# Altium schematic sheet Sheet1.SchDoc
size A2
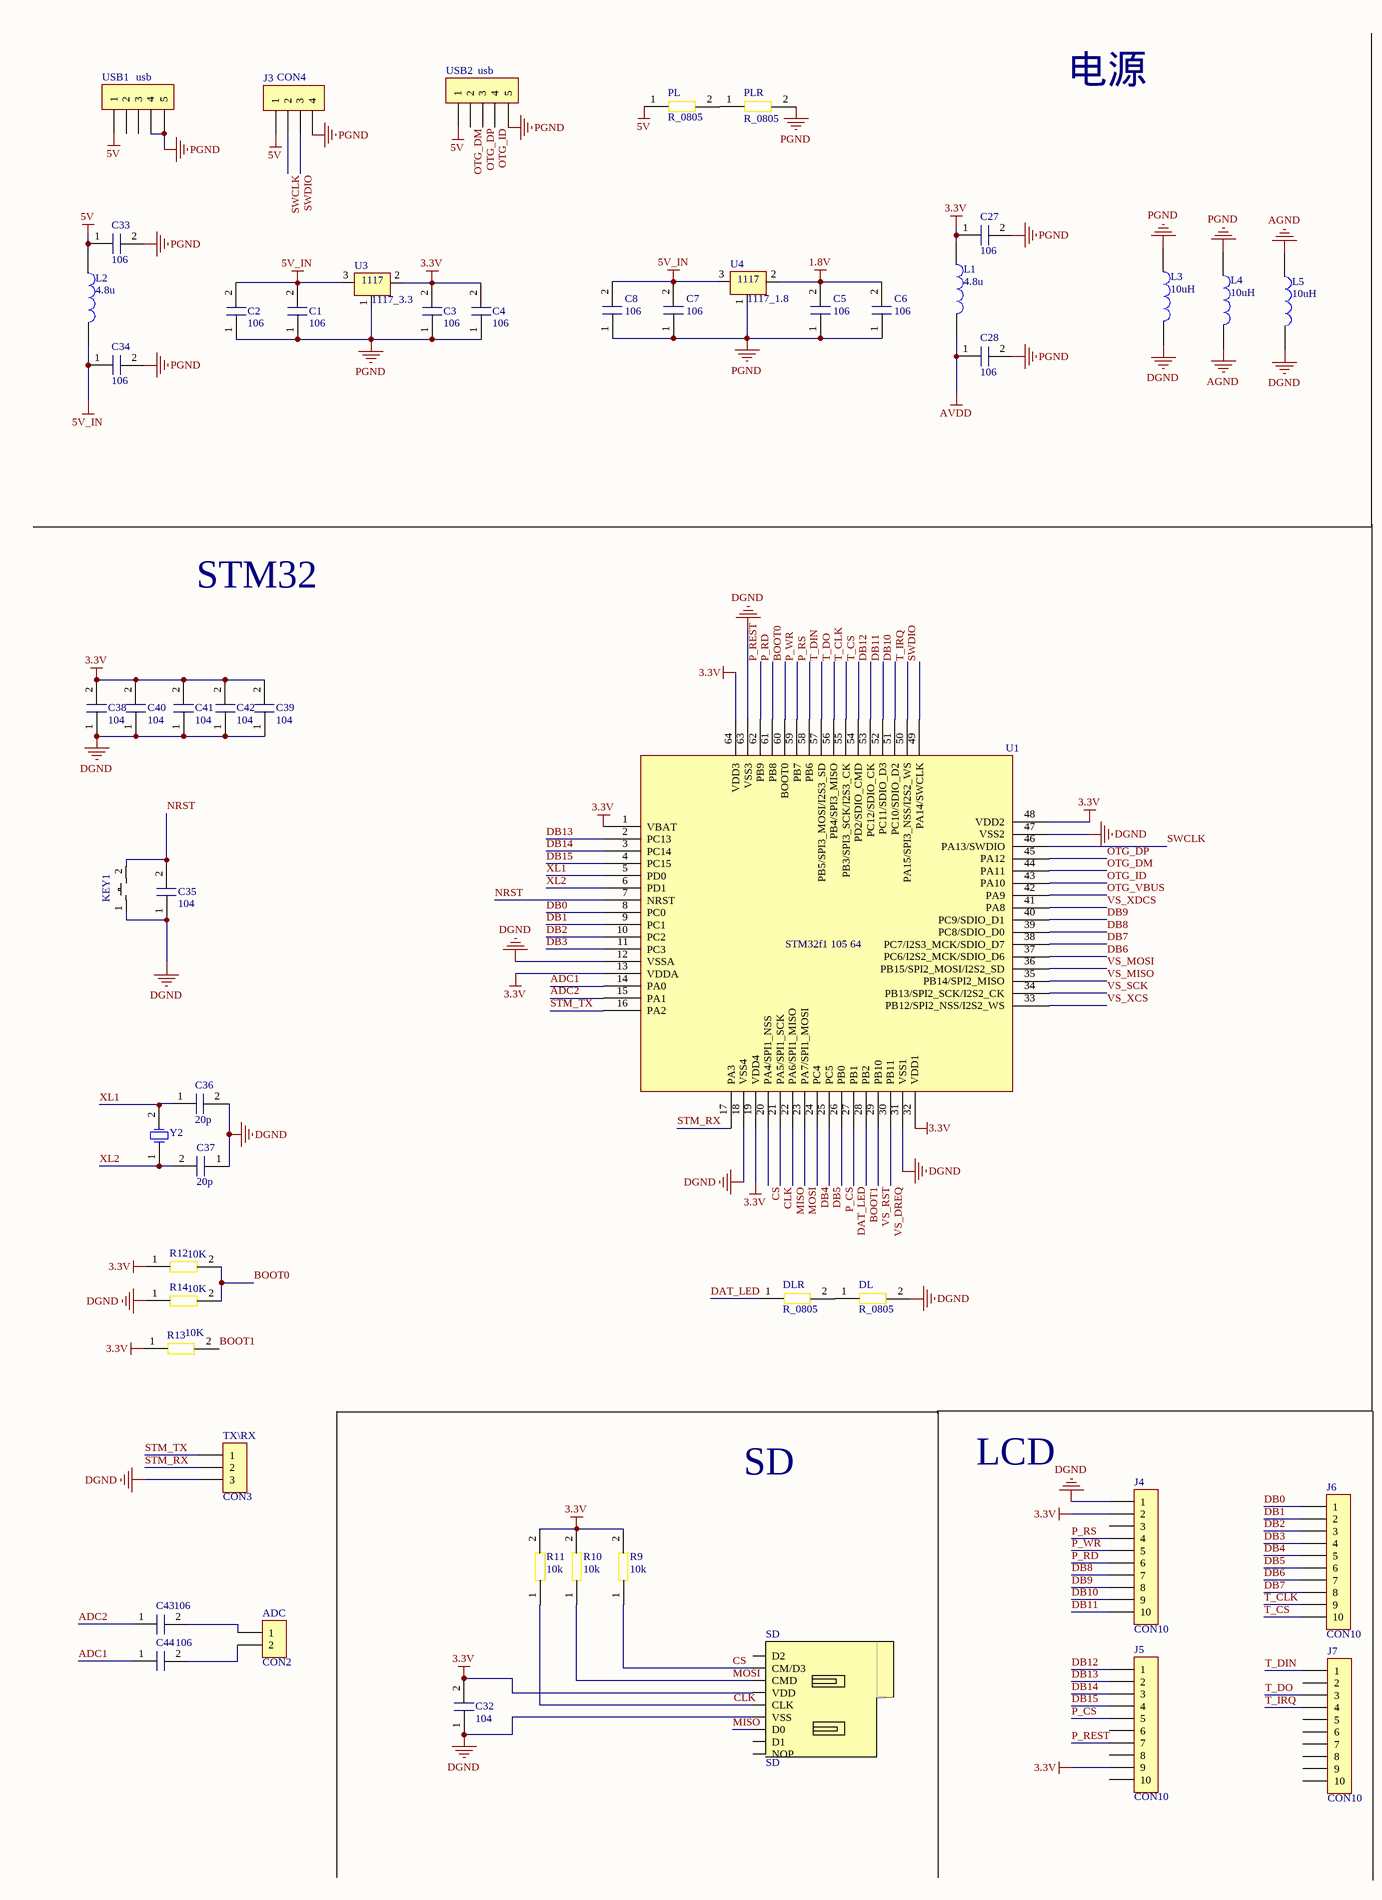
[diagram p0: Sheet1.SchDoc, left]
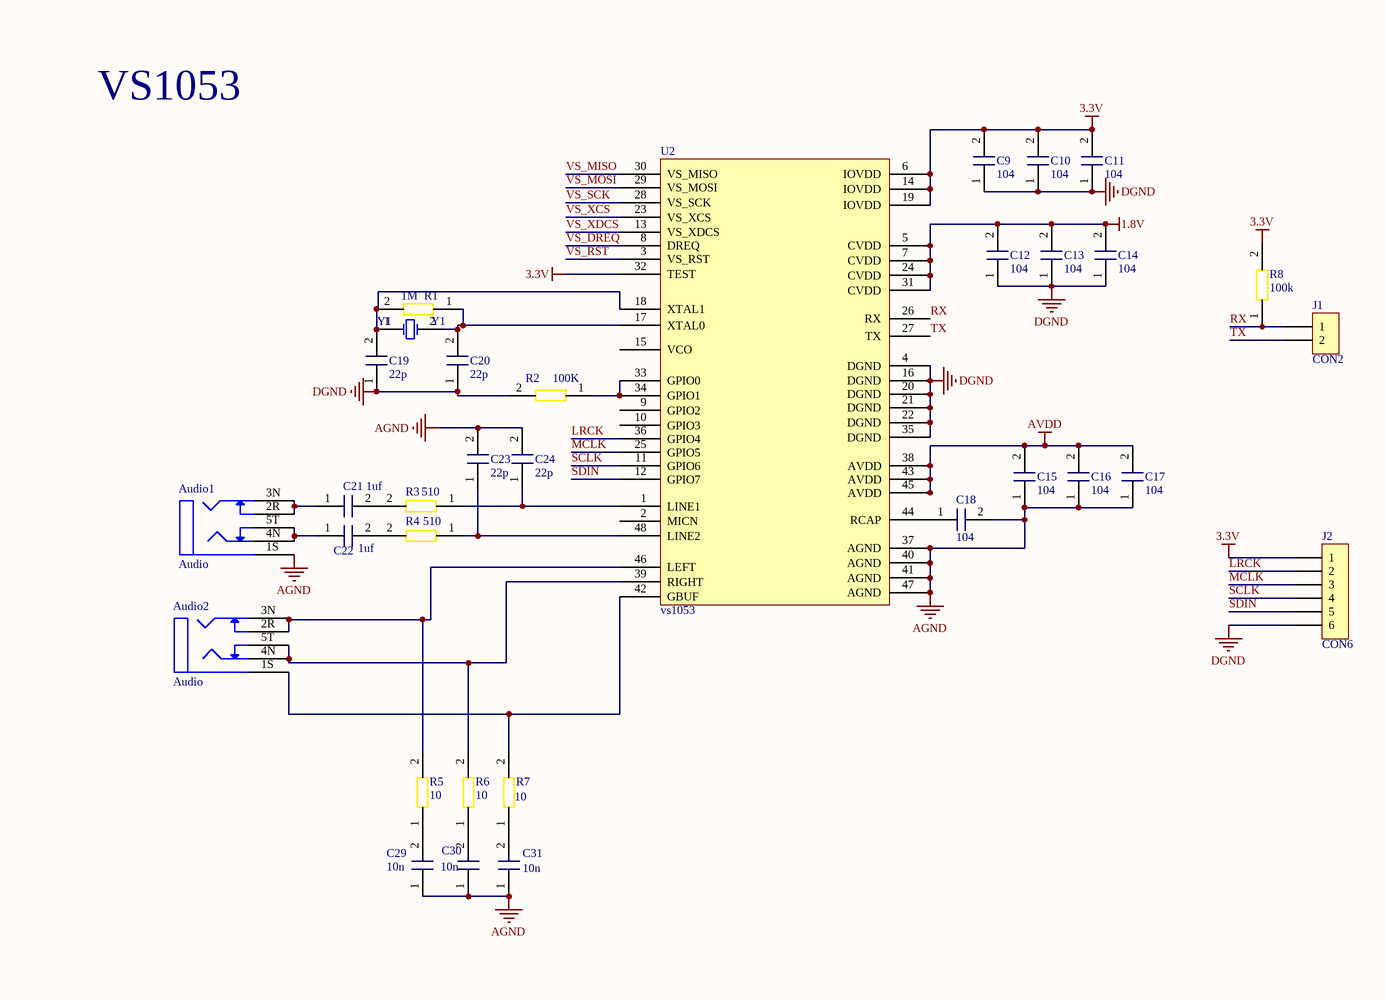
[diagram p1: Sheet1.SchDoc, right]

## Parts
ADC  CON2  [SIP2]
Audio1  Audio  [AUDIO]
Audio2  Audio  [AUDIO]
C1  106  [电容器]
C2  106  [电容器]
C3  106  [电容器]
C4  106  [电容器]
C5  106  [电容器]
C6  106  [电容器]
C7  106  [电容器]
C8  106  [电容器]
C9  104  [电容器]
C10  104  [电容器]
C11  104  [电容器]
C12  104  [电容器]
C13  104  [电容器]
C14  104  [电容器]
C15  104  [电容器]
C16  104  [电容器]
C17  104  [电容器]
C18  104  [电容器]
C19  22p  [电容器]
C20  22p  [电容器]
C21  1uf  [电容器]
C22  1uf  [电容器]
C23  22p  [电容器]
C24  22p  [电容器]
C27  106  [电容器]
C28  106  [电容器]
C29  10n  [电容器]
C30  10n  [电容器]
C31  10n  [电容器]
C32  104  [电容器]
C33  106  [电容器]
C34  106  [电容器]
C35  104  [电容器]
C36  20p  [电容器]
C37  20p  [电容器]
C38  104  [电容器]
C39  104  [电容器]
C40  104  [电容器]
C41  104  [电容器]
C42  104  [电容器]
C43  106  [电容器]
C44  106  [电容器]
DL  R_0805  [R_0805]
DLR  R_0805  [R_0805]
J1  CON2  [SIP2]
J2  CON6  [SIP6]
J3  CON4  [SIP4]
J4  CON10  [sip10]
J5  CON10  [sip10]
J6  CON10  [sip10]
J7  CON10  [sip10]
KEY1  KEY  [KEY]  (value not drawn)
L1  4.8u  [L]
L2  4.8u  [L]
L3  10uH  [L]
L4  10uH  [L]
L5  10uH  [L]
PL  R_0805  [R_0805]
PLR  R_0805  [R_0805]
R1  1M  [R_0805]
R2  100K  [R_0805]
R3  510  [R_0805]
R4  510  [R_0805]
R5  10  [R_0805]
R6  10  [R_0805]
R7  10  [R_0805]
R8  100k  [R_0805]
R9  10k  [R_0805]
R10  10k  [R_0805]
R11  10k  [R_0805]
R12  10K  [R_0805]
R13  10K  [R_0805]
R14  10K  [R_0805]
SD  SD  [TF卡座]
TX\RX  CON3  [SIP3]
U1  STM32f1 105 64  [LQPF64_STM32]
U2  vs1053  [QFP48]
U3  1117_3.3  [SOT230P700X180-4N]
U4  1117_1.8  [SOT230P700X180-4N]
USB1  usb  [micro-USB]
USB2  usb  [micro-USB]
Y1  Y1  [XTAL]
Y2  Y  [XTAL]  (value not drawn)

## Nets
1.8V: C5.2(c+) C6.2(c+) C12.2(c+) C13.2(c+) C14.2(c+) U2.5(CVDD) U2.7(CVDD) U2.24(CVDD) U2.31(CVDD) U4.2(OUT)
3.3V: C3.2(c+) C4.2(c+) C9.2(c+) C10.2(c+) C11.2(c+) C27.1(c) C32.2(c+) C38.2(c+) C39.2(c+) C40.2(c+) C41.2(c+) C42.2(c+) J2.1 J4.2 J5.9 L1.2 R8.2 R9.2 R10.2 R11.2 R12.1 R13.1 SD.4(VDD) U1.1(VBAT) U1.13(VDDA) U1.19(VDD4) U1.32(VDD1) U1.48(VDD2) U1.64(VDD3) U2.6(IOVDD) U2.14(IOVDD) U2.19(IOVDD) U2.32(TEST) U3.2(OUT)
5V: C33.1(c) J3.1 L2.2 PL.1 USB1.1 USB2.1
5V_IN: C1.2(c+) C2.2(c+) C7.2(c+) C8.2(c+) C34.1(c) L2.1 U3.3(IN) U4.3(IN)
AGND: Audio1.1S C15.1(c) C16.1(c) C17.1(c) C18.2(c+) C23.2(c+) C24.2(c+) C29.1(c) C30.1(c) C31.1(c) L4.1 L5.2 U2.37(AGND) U2.40(AGND) U2.41(AGND) U2.47(AGND)
AVDD: C15.2(c+) C16.2(c+) C17.2(c+) C28.1(c) L1.1 U2.38(AVDD) U2.43(AVDD) U2.45(AVDD)
DGND: C9.1(c) C10.1(c) C11.1(c) C12.1(c) C13.1(c) C14.1(c) C19.1(c) C20.1(c) C32.1(c) C35.1(c) C36.2(c+) C37.1(c) C38.1(c) C39.1(c) C40.1(c) C41.1(c) C42.1(c) DL.2 J2.6 J4.1 KEY1.1 L3.1 L5.1 R2.2 R14.1 SD.6(VSS) TX\RX.3 U1.12(VSSA) U1.18(VSS4) U1.31(VSS1) U1.47(VSS2) U1.63(VSS3) U2.4(DGND) U2.16(DGND) U2.20(DGND) U2.21(DGND) U2.22(DGND) U2.35(DGND)
PGND: C1.1(c) C2.1(c) C3.1(c) C4.1(c) C5.1(c) C6.1(c) C7.1(c) C8.1(c) C27.2(c+) C28.2(c+) C33.2(c+) C34.2(c+) J3.4 L3.2 L4.2 PLR.2 U3.1(ADJ) U4.1(ADJ) USB1.4 USB1.5 USB2.5
ADC1: C44.1(c) U1.14(PA0)
ADC2: C43.1(c) U1.15(PA1)
BOOT0: R12.2 R14.2 U1.60(BOOT0)
BOOT1: R13.2 U1.28(PB2)
CLK: R11.1 SD.5(CLK) U1.21(PA5/SPI1_SCK)
CS: R9.1 SD.2(CM/D3) U1.20(PA4/SPI1_NSS)
DAT_LED: DLR.1 U1.27(PB1)
DB0: J6.1 U1.8(PC0)
DB1: J6.2 U1.9(PC1)
DB2: J6.3 U1.10(PC2)
DB3: J6.4 U1.11(PC3)
DB4: J6.5 U1.24(PC4)
DB5: J6.6 U1.25(PC5)
DB6: J6.7 U1.37(PC6/I2S2_MCK/SDIO_D6)
DB7: J6.8 U1.38(PC7/I2S3_MCK/SDIO_D7)
DB8: J4.7 U1.39(PC8/SDIO_D0)
DB9: J4.8 U1.40(PC9/SDIO_D1)
DB10: J4.9 U1.51(PC10/SDIO_D2)
DB11: J4.10 U1.52(PC11/SDIO_D3)
DB12: J5.1 U1.53(PC12/SDIO_CK)
DB13: J5.2 U1.2(PC13)
DB14: J5.3 U1.3(PC14)
DB15: J5.4 U1.4(PC15)
LRCK: J2.2 U2.36(GPIO4)
MCLK: J2.3 U2.25(GPIO5)
MISO: SD.7(D0) U1.22(PA6/SPI1_MISO)
MOSI: R10.1 SD.3(CMD) U1.23(PA7/SPI1_MOSI)
NRST: C35.2(c+) KEY1.2 U1.7(NRST)
OTG_DM: U1.44(PA11) USB2.2
OTG_DP: U1.45(PA12) USB2.3
OTG_ID: U1.43(PA10) USB2.4
OTG_VBUS: U1.42(PA9)
P_CS: J5.5 U1.26(PB0)
P_RD: J4.6 U1.61(PB8)
P_REST: J5.7 U1.62(PB9)
P_RS: J4.4 U1.58(PB6)
P_WR: J4.5 U1.59(PB7)
RX: J1.1 R8.1 U2.26(RX)
SCLK: J2.4 U2.11(GPIO6)
SDIN: J2.5 U2.12(GPIO7)
STM_RX: TX\RX.2 U1.17(PA3)
STM_TX: TX\RX.1 U1.16(PA2)
SWCLK: J3.2 U1.46(PA13/SWDIO)
SWDIO: J3.3 U1.49(PA14/SWCLK)
T_CLK: J6.9 U1.55(PB3/SPI3_SCK/I2S3_CK)
T_CS: J6.10 U1.54(PD2/SDIO_CMD)
T_DIN: J7.1 U1.57(PB5/SPI3_MOSI/I2S3_SD)
T_DO: J7.3 U1.56(PB4/SPI3_MISO)
T_IRQ: J7.4 U1.50(PA15/SPI3_NSS/I2S2_WS)
TX: J1.2 U2.27(TX)
VS_DREQ: U1.30(PB11) U2.8(DREQ)
VS_MISO: U1.35(PB14/SPI2_MISO) U2.30(VS_MISO)
VS_MOSI: U1.36(PB15/SPI2_MOSI/I2S2_SD) U2.29(VS_MOSI)
VS_RST: U1.29(PB10) U2.3(VS_RST)
VS_SCK: U1.34(PB13/SPI2_SCK/I2S2_CK) U2.28(VS_SCK)
VS_XCS: U1.33(PB12/SPI2_NSS/I2S2_WS) U2.23(VS_XCS)
VS_XDCS: U1.41(PA8) U2.13(VS_XDCS)
XL1: C36.1(c) U1.5(PD0) Y2.2(OSC2)
XL2: C37.2(c+) U1.6(PD1) Y2.1(OSC1)
NetADC_1: ADC.1 C43.2(c+)
NetADC_2: ADC.2 C44.2(c+)
NetAudio1_2R: Audio1.2R Audio1.3N C21.1(c)
NetAudio1_4N: Audio1.4N Audio1.5T C22.1(c)
NetAudio2_1S: Audio2.1S R7.2 U2.42(GBUF)
NetAudio2_2R: Audio2.2R Audio2.3N R5.2 U2.46(LEFT)
NetAudio2_4N: Audio2.4N Audio2.5T R6.2 U2.39(RIGHT)
NetC18_1: C18.1(c) U2.44(RCAP)
NetC19_2: C19.2(c+) R1.2 U2.18(XTAL1) Y1.1(OSC1)
NetC20_2: C20.2(c+) R1.1 U2.17(XTAL0) Y1.2(OSC2)
NetC21_2: C21.2(c+) R3.2
NetC22_2: C22.2(c+) R4.2
NetC23_1: C23.1(c) R4.1 U2.48(LINE2)
NetC24_1: C24.1(c) R3.1 U2.1(LINE1)
NetC29_2: C29.2(c+) R5.1
NetC30_2: C30.2(c+) R6.1
NetC31_2: C31.2(c+) R7.1
NetDL_1: DL.1 DLR.2
NetPL_2: PL.2 PLR.1
NetR2_1: R2.1 U2.33(GPIO0) U2.34(GPIO1)

Not connected (* = marked no-connect by the designer): J4 3; J5 6 8 10; J7 2 5 6 7 8 9 10; SD 1(D2) 8(D1) 9(NOP); U2 2(MICN) 9(GPIO2) 10(GPIO3) 15(VCO); USB1 2 3

## Notes on the sheet
- 电源
- VS1053
- STM32
- SD
- LCD

## Library data of the parts
C1-C24 C27-C44 = cpp
L1-L5 = L
R1-R14 = R_0805
SD = TF卡座
U1 = STM32f1 103 64
U3 U4 = 1117
USB1 USB2 = CON4
Y1 Y2 = XTAL: Crystal Oscillator; Published: 8-Jun-2000; LatestRevisionDate: 17-Jul-2002; LatestRevisionNote: Re-released for DXP Platform.; PackageReference: R38; Publisher: Altium Limited